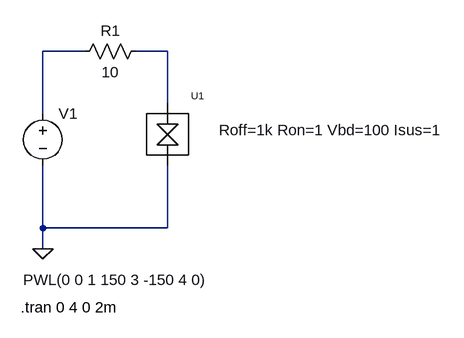
[diagram p0: schematic SparkGapTest.asc]
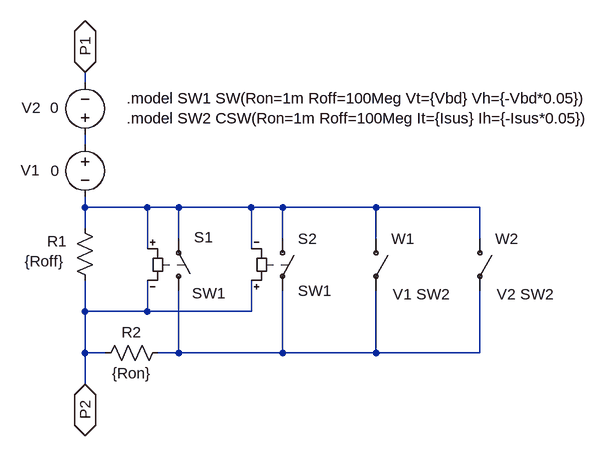
[diagram p1: sub-circuit simplesparkgap.asc]
SparkGapTest.asc, the LTspice schematic file:
Version 4
SHEET 1 880 680
WIRE -176 208 -176 112
WIRE -176 384 -176 288
WIRE -176 416 -176 384
WIRE -112 112 -176 112
WIRE 16 112 -32 112
WIRE 16 192 16 112
WIRE 16 384 -176 384
WIRE 16 384 16 288
FLAG -176 416 0
SYMBOL SimpleSparkGap 16 240 R0
SYMATTR Value2 Roff=1k Ron=1 Vbd=100 Isus=1
SYMATTR InstName U1
SYMBOL voltage -176 192 R0
WINDOW 3 -30 272 Left 0
WINDOW 123 0 0 Left 0
WINDOW 39 0 0 Left 0
SYMATTR InstName V1
SYMATTR Value PWL(0 0 1 150 3 -150 4 0)
SYMBOL res -128 128 R270
WINDOW 0 32 56 VTop 0
WINDOW 3 0 56 VBottom 0
SYMATTR InstName R1
SYMATTR Value 10
TEXT -210 506 Left 0 !.tran 0 4 0 2m

simplesparkgap.asc, the sub-circuit schematic file:
Version 4
SHEET 1 880 680
WIRE -304 0 -304 -16
WIRE -304 96 -304 80
WIRE -304 192 -304 176
WIRE -304 224 -304 192
WIRE -304 352 -304 304
WIRE -304 416 -304 352
WIRE -304 464 -304 416
WIRE -272 416 -304 416
WIRE -208 192 -304 192
WIRE -208 256 -208 192
WIRE -208 352 -304 352
WIRE -208 352 -208 304
WIRE -160 192 -208 192
WIRE -160 240 -160 192
WIRE -160 416 -192 416
WIRE -160 416 -160 320
WIRE -48 192 -160 192
WIRE -48 256 -48 192
WIRE -48 352 -208 352
WIRE -48 352 -48 304
WIRE 0 192 -48 192
WIRE 0 240 0 192
WIRE 0 416 -160 416
WIRE 0 416 0 320
WIRE 144 192 0 192
WIRE 144 240 144 192
WIRE 144 416 0 416
WIRE 144 416 144 320
WIRE 304 192 144 192
WIRE 304 240 304 192
WIRE 304 416 144 416
WIRE 304 416 304 320
FLAG -304 -16 P1
IOPIN -304 -16 BiDir
FLAG -304 464 P2
IOPIN -304 464 BiDir
SYMBOL sw -160 336 M180
WINDOW 0 24 98 Left 0
WINDOW 3 21 12 Left 0
SYMATTR InstName S1
SYMATTR Value SW1
SYMBOL csw 144 240 R0
WINDOW 3 26 86 Left 0
SYMATTR Value V1 SW2
SYMATTR InstName W1
SYMBOL voltage -304 80 R0
WINDOW 0 -99 55 Left 0
WINDOW 3 -53 56 Left 0
WINDOW 123 0 0 Left 0
WINDOW 39 0 0 Left 0
SYMATTR InstName V1
SYMATTR Value 0
SYMBOL res -320 208 R0
WINDOW 0 -42 36 Left 0
WINDOW 3 -77 67 Left 0
SYMATTR InstName R1
SYMATTR Value {Roff}
SYMBOL res -176 400 R90
WINDOW 0 0 56 VBottom 0
WINDOW 3 32 56 VTop 0
SYMATTR InstName R2
SYMATTR Value {Ron}
SYMBOL csw 304 240 R0
WINDOW 3 26 86 Left 0
SYMATTR Value V2 SW2
SYMATTR InstName W2
SYMBOL voltage -304 96 R180
WINDOW 0 68 57 Left 0
WINDOW 3 40 57 Left 0
WINDOW 123 0 0 Left 0
WINDOW 39 0 0 Left 0
SYMATTR InstName V2
SYMATTR Value 0
SYMBOL sw 0 224 R0
SYMATTR InstName S2
SYMATTR Value SW1
TEXT -240 24 Left 0 !.model SW1 SW(Ron=1m Roff=100Meg Vt={Vbd} Vh={-Vbd*0.05})\n.model SW2 CSW(Ron=1m Roff=100Meg It={Isus} Ih={-Isus*0.05})

The netlist it stands for:
* SparkGapTest.asc
XU1 N002 0 simplesparkgap params: Roff=1k Ron=1 Vbd=100 Isus=1
V1 N001 0 PWL(0 0 1 150 3 -150 4 0)
R1 N001 N002 10

* block symbol definitions
.subckt simplesparkgap P1 P2
S1 N003 N002 N002 P2 SW1
W1 N002 N003 V1 SW2
V1 N001 N002 0
R1 N002 P2 {Roff}
R2 N003 P2 {Ron}
W2 N002 N003 V2 SW2
V2 N001 P1 0
S2 N002 N003 P2 N002 SW1
.model SW1 SW(Ron=1m Roff=100Meg Vt={Vbd} Vh={-Vbd*0.05})
.model SW2 CSW(Ron=1m Roff=100Meg It={Isus} Ih={-Isus*0.05})
.ends simplesparkgap

.tran 0 4 0 2m
.lib simplesparkgap.sub
.backanno
.end